# Altium schematic sheet 4GModule-MiniPCI-E.SchDoc
size A2
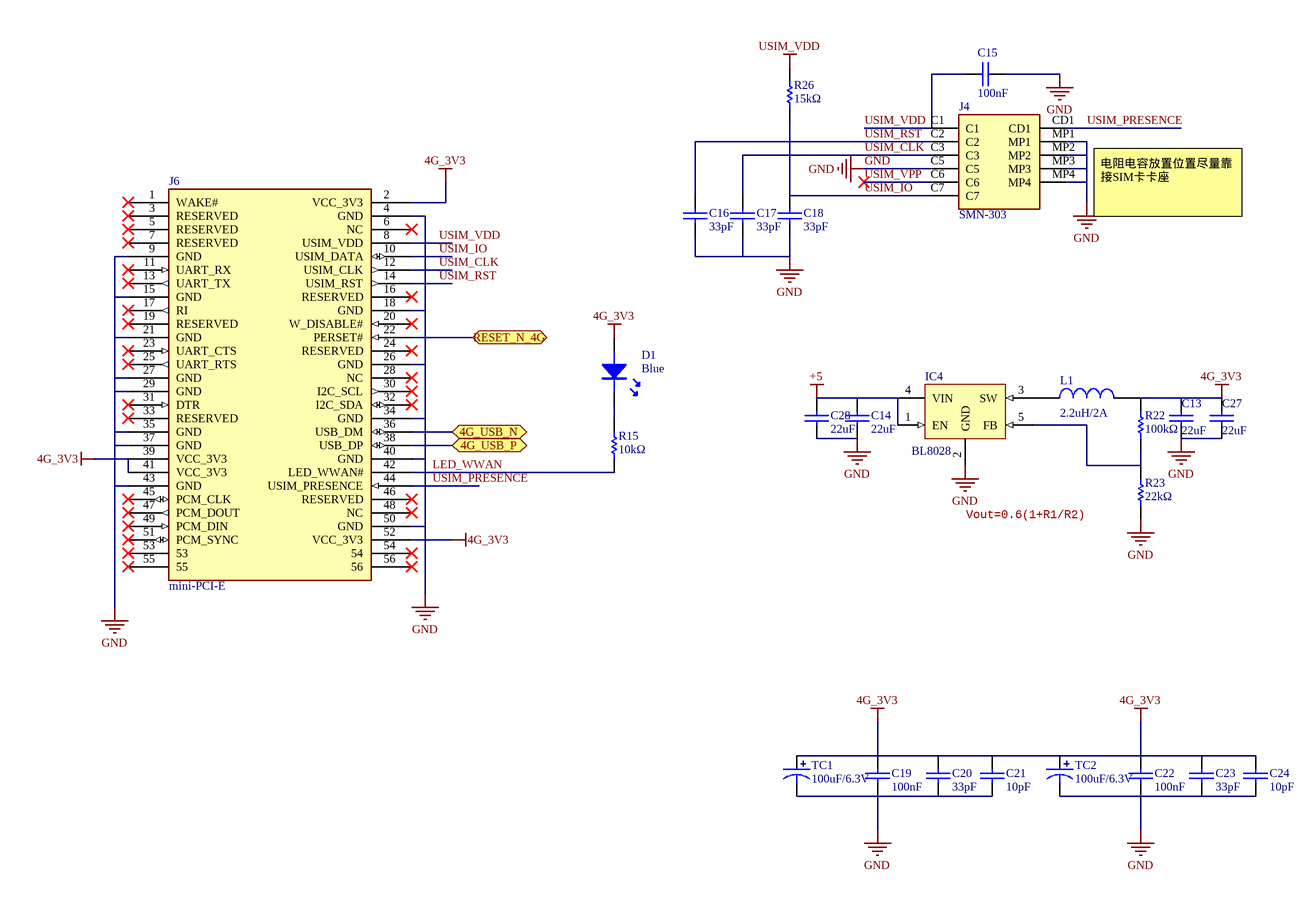
[diagram p0: 4GModule-MiniPCI-E.SchDoc]

## Parts
C13  22uF  [C_0603]
C14  22uF  [C_0603]
C15  100nF  [C_0402]
C16  33pF  [C_0402]
C17  33pF  [C_0402]
C18  33pF  [C_0402]
C19  100nF  [C_0402]
C20  33pF  [C_0402]
C21  10pF  [C_0402]
C22  100nF  [C_0402]
C23  33pF  [C_0402]
C24  10pF  [C_0402]
C27  22uF  [C_0603]
C28  22uF  [C_0603]
D1  Blue  [LED-0603-B]
IC4  BL8028  [SOT23-5]
J4  SMN-303  [SimCard_SMN-303]
J6  mini-PCI-E  [CardEdge_MINI-PCI-E-4H]
L1  2.2uH/2A  [L_1008]
R15  10kΩ  [R_0402]
R22  100kΩ  [R_0402]
R23  22kΩ  [R_0402]
R26  15kΩ  [R_0402]
TC1  100uF/6.3V  [TAJ-B/3528]
TC2  100uF/6.3V  [TAJ-B/3528]

## Ports
4G_USB_N (bidir), 4G_USB_P (bidir), RESET_N_4G (bidir)

## Nets
4G_3V3: C13.2 C19.2 C20.2 C21.2 C22.2 C23.2 C24.2 C27.2 D1.A J6.2(VCC_3V3) J6.39(VCC_3V3) J6.41(VCC_3V3) J6.52(VCC_3V3) L1.2 R22.2 TC1.1 TC2.1
+5: C14.2 C28.2 IC4.1(EN) IC4.4(VIN)
GND: C13.1 C14.1 C15.1 C16.1 C17.1 C18.1 C19.1 C20.1 C21.1 C22.1 C23.1 C24.1 C27.1 C28.1 IC4.2(GND) J4.C5 J4.MP1 J4.MP2 J4.MP3 J4.MP4 J6.4(GND) J6.9(GND) J6.15(GND) J6.18(GND) J6.21(GND) J6.26(GND) J6.27(GND) J6.29(GND) J6.34(GND) J6.35(GND) J6.37(GND) J6.40(GND) J6.43(GND) J6.50(GND) R23.1 TC1.2 TC2.2
USIM_VDD: C15.2 J4.C1 J6.8(USIM_VDD) R26.2
4G_USB_N: J6.36(USB_DM) ; port 4G_USB_N
4G_USB_P: J6.38(USB_DP) ; port 4G_USB_P
LED_WWAN: J6.42(LED_WWAN#) R15.1
RESET_N_4G: J6.22(PERSET#) ; port RESET_N_4G
USIM_CLK: C17.2 J4.C3 J6.12(USIM_CLK)
USIM_IO: C18.2 J4.C7 J6.10(USIM_DATA) R26.1
USIM_PRESENCE: J4.CD1 J6.44(USIM_PRESENCE)
USIM_RST: C16.2 J4.C2 J6.14(USIM_RST)
USIM_VPP: J4.C6
NetD1_K: D1.K R15.2
NetIC4_3: IC4.3(SW) L1.1
NetIC4_5: IC4.5(FB) R22.1 R23.2

Not connected (* = marked no-connect by the designer): J6 1(WAKE#)* 3(RESERVED)* 5(RESERVED)* 6(NC)* 7(RESERVED)* 11(UART_RX)* 13(UART_TX)* 16(RESERVED)* 17(RI)* 19(RESERVED)* 20(W_DISABLE#)* 23(UART_CTS)* 24(RESERVED)* 25(UART_RTS)* 28(NC)* 30(I2C_SCL)* 31(DTR)* 32(I2C_SDA)* 33(RESERVED)* 45(PCM_CLK)* 46(RESERVED)* 47(PCM_DOUT)* 48(NC)* 49(PCM_DIN)* 51(PCM_SYNC)* 53* 54* 55* 56*

## Notes on the sheet
- 电阻电容放置位置尽量靠接SIM卡卡座
- Vout=0.6(1+R1/R2)

## Library data of the parts
C13-C24 C27 C28 = Cap_Chip: 贴片电容; Manufacturer_Name: *; Manufacturer_Part_Number: *
D1 = LED_Chip: 贴片LED; 厂家型号: *; 商品编号: *
IC4 = BL8028: DC-DC 芯片
J4 = SimCard_Nano: NANO SIM卡座; Manufacturer_Part_Number: SMN-303; 厂家型号: *; 商品编号: *
J6 = CardEdge_MiniPCI-E: EC25 mini-PCI-E 座子; Manufacturer_Name: *; Manufacturer_Part_Number: *
L1 = Ind_Chip: 小功率电感; Manufacturer_Name: chilisin(奇力新); Manufacturer_Part_Number: BDCD002520122R2MS1
R15 R22 R23 R26 = Res_Chip: 贴片电阻; Manufacturer_Name: *; Manufacturer_Part_Number: *
TC1 TC2 = Cap_TAN: 钽电容; 厂家型号: *; 商品编号: *